# EAGLE schematic Arduino_Shield_3_4_19_REV2 (EAGLE 9.3.1)
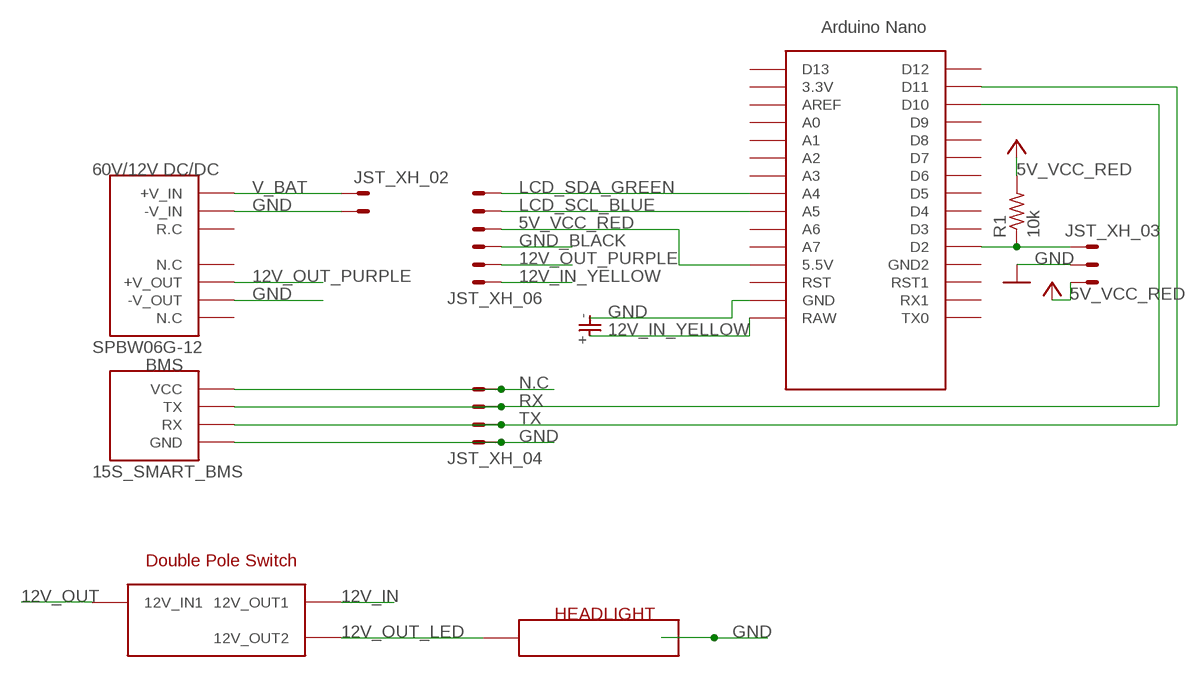
[diagram p0: schematic, sheet 1]

## Parts
R1  10k  R-US_R0805  [R0805]
U$1  NANO  [NANO]
U$2  SPBW06G-12  [SPBW06G-12]
U$3  THROUGHHOLE_CAP  [THROUGHHOLE_CAP]
U$4  SWITCH  (no package)
U$5  HEADLIGHT  (no package)
U$6  15S_SMART_BMS  (no package)
X1  JST_XH_04  JST-XH-04-PIN-LONG-PAD  [JST-XH-04-PACKAGE-LONG-PAD]
X2  JST_XH_06  JST-XH-06-PIN-LONG-PAD  [JST-XH-06-PACKAGE-LONG-PAD]
X4  JST_XH_02  JST-XH-02-PIN-LONG-PAD  [JST-XH-02-PACKAGE-LONG-PAD]
X5  JST_XH_03  JST-XH-03-PIN-LONG-PAD  [JST-XH-03-PACKAGE-LONG-PAD]

## Nets
5V_VCC_RED: R1.2 U$1.5V(5.5V) X2.4 X5.3 ; supply symbol labelled VCC
12V_IN: U$4.12V_OUT1
12V_IN_YELLOW: U$1.RAW U$3.+ X2.1
12V_OUT [POWER]: U$4.12V_IN1
12V_OUT_LED: U$4.12V_OUT2 U$5.P$1
12V_OUT_PURPLE: U$2.+V_OUT X2.2
GND: U$1.GND U$2.-V_IN U$2.-V_OUT U$3.- U$5.P$2 U$6.GND X1.1 X4.2 X5.2
GND_BLACK: X2.3
LCD_SCL_BLUE: U$1.A5 X2.5
LCD_SDA_GREEN: U$1.A4 X2.6
N$4: R1.1 U$1.D2 X5.1
N.C: U$6.VCC X1.4
RX: U$1.D10 U$6.TX X1.3
TX: U$1.D11 U$6.RX X1.2
V_BAT: U$2.+V_IN X4.1
Unconnected: U$1.3.3V U$1.A0 U$1.A1 U$1.A2 U$1.A3 U$1.A6 U$1.A7 U$1.AREF U$1.D3 U$1.D4 U$1.D5 U$1.D6 U$1.D7 U$1.D8 U$1.D9 U$1.D12 U$1.D13 U$1.GND1(GND2) U$1.ICSP1 U$1.ICSP2 U$1.ICSP3 U$1.ICSP4 U$1.ICSP5 U$1.ICSP6 U$1.RST U$1.RST1 U$1.RX1 U$1.TX0 U$2.N.C U$2.N.C@8(N.C) U$2.R.C

## Library data of the parts
R1 = adafruit:R-US_: RESISTOR, American symbol
U$1 = Arduino-clone:NANO: Arduino Nano
U$2 = Bryan's_Library:SPBW06G-12
U$3 = Bryan's_Library:THROUGHHOLE_CAP
U$4 = Bryan's_Library:SWITCH
U$5 = Bryan's_Library:HEADLIGHT
U$6 = Bryan's_Library:15S_SMART_BMS
X1 = Rembrandt Electronics - JST XH Connectors v1-0:JST-XH-04-PIN: JST XH Connector 2 Pin Wire to board connector. Pitch: 2,54 mm, (0.100") Number of pins: 4 Created by Rembrandt Electronics www.rembrandtelectronics.com
X2 = Rembrandt Electronics - JST XH Connectors v1-0:JST-XH-06-PIN: JST XH Connector 2 Pin Wire to board connector. Pitch: 2,54 mm, (0.100") Number of pins: 6 Created by Rembrandt Electronics www.rembrandtelectronics.com
X4 = Rembrandt Electronics - JST XH Connectors v1-0:JST-XH-02-PIN: JST XH Connector 2 Pin Wire to board connector. Pitch: 2,54 mm, (0.100") Number of pins: 2 Created by Rembrandt Electronics www.rembrandtelectronics.com
X5 = Rembrandt Electronics - JST XH Connectors v1-0:JST-XH-03-PIN: JST XH Connector 2 Pin Wire to board connector. Pitch: 2,54 mm, (0.100") Number of pins: 3 Created by Rembrandt Electronics www.rembrandtelectronics.com

## Net classes
0 default: width 0.305 mm, clearance 0.254 mm
1 POWER: width 0.762 mm, clearance 0.762 mm